# Altium schematic sheet STMWidthSensing.SchDoc
size 297 x 209 mm
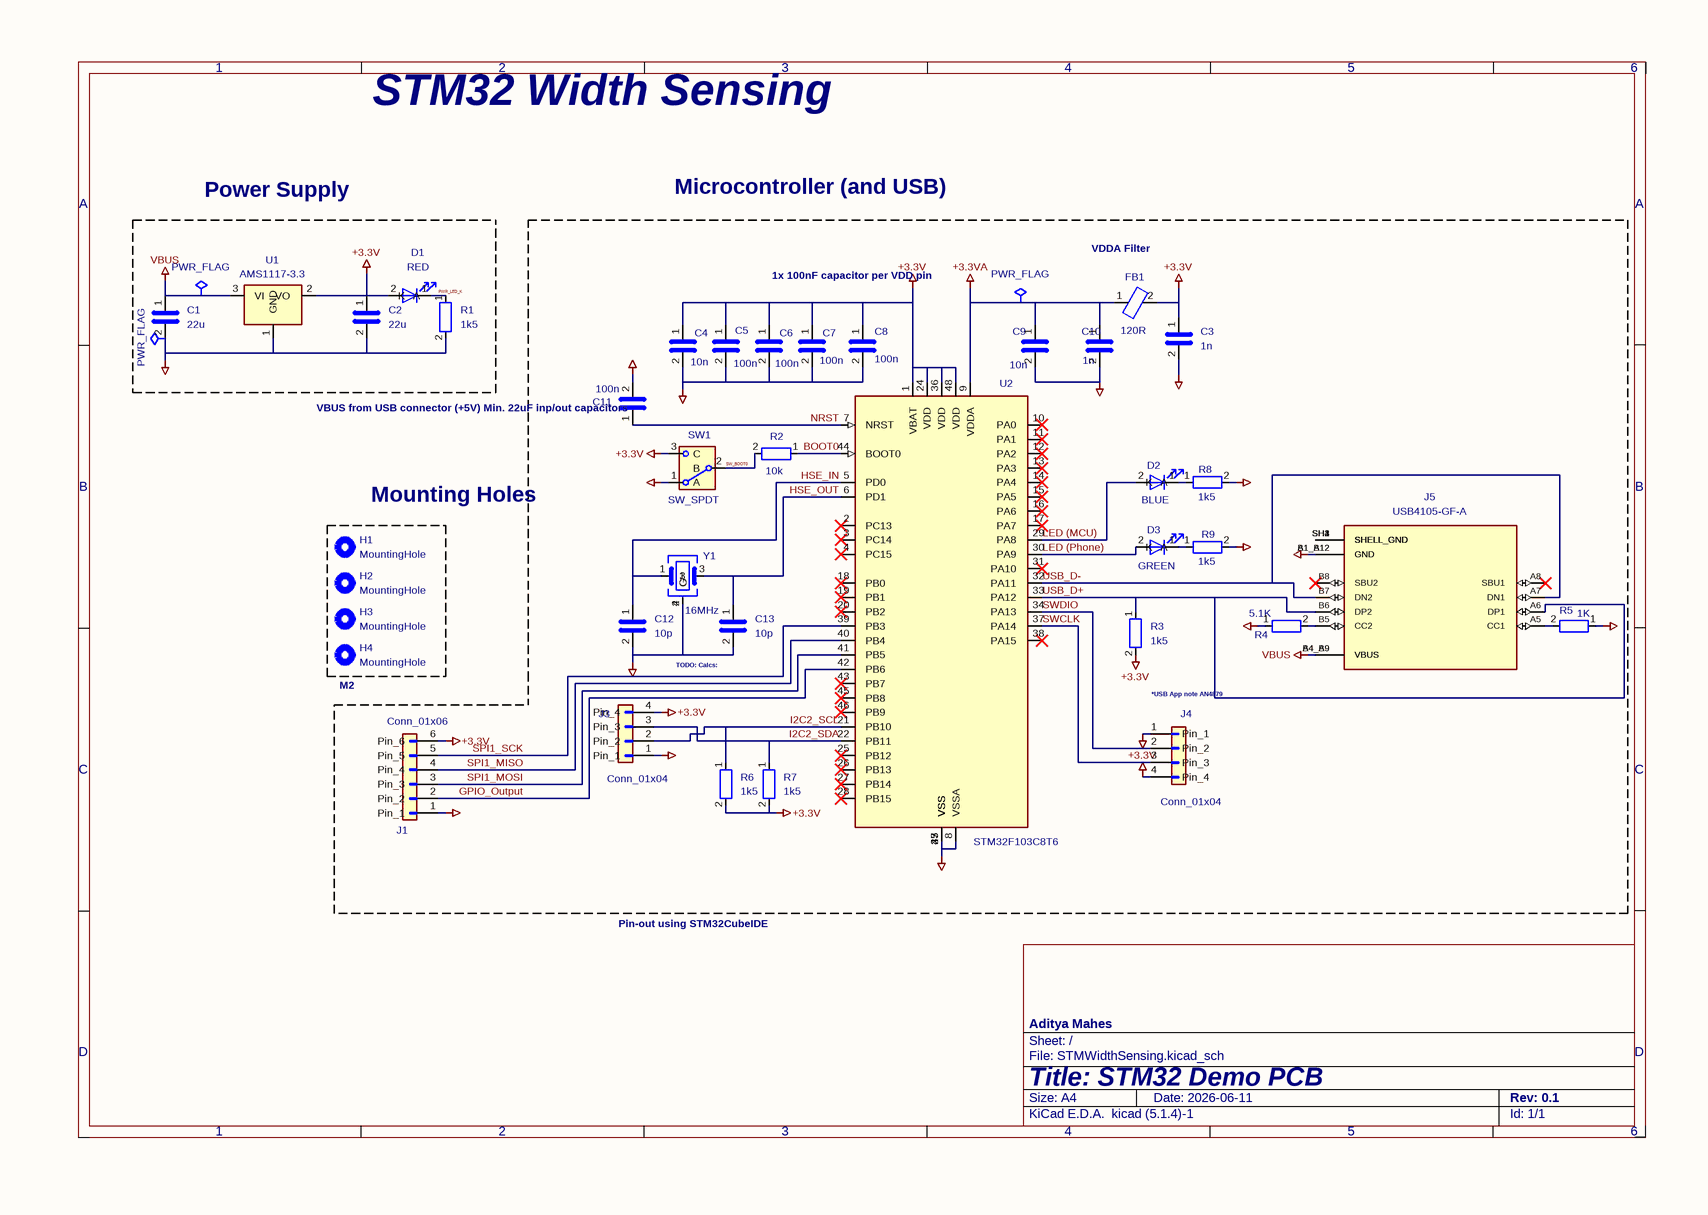
[diagram p0: STMWidthSensing.SchDoc]

## Parts
#FLG01  PWR_FLAG  (graphical)
#FLG02  PWR_FLAG  (graphical)
#FLG03  PWR_FLAG  (graphical)
C1  22u  [C_0805_2012Metric]
C2  22u  [C_0805_2012Metric]
C3  1n  [C_0402_1005Metric]
C4  10n  [C_0603_1608Metric]
C5  100n  [C_0402_1005Metric]
C6  100n  [C_0402_1005Metric]
C7  100n  [C_0402_1005Metric]
C8  100n  [C_0402_1005Metric]
C9  10n  [C_0402_1005Metric]
C10  1n  [C_0402_1005Metric]
C11  100n  [C_0402_1005Metric]
C12  10p  [C_0402_1005Metric]
C13  10p  [C_0402_1005Metric]
D1  RED  [LED_0603_1608Metric]
D2  BLUE  [LED_0603_1608Metric]
D3  GREEN  [LED_0603_1608Metric]
FB1  120R  [L_0603_1608Metric]
H1  MountingHole  [MountingHole_2.2mm_M2]
H2  MountingHole  [MountingHole_2.2mm_M2]
H3  MountingHole  [MountingHole_2.2mm_M2]
H4  MountingHole  [MountingHole_2.2mm_M2]
J1  Conn_01x06  [PinHeader_1x06_P2.54mm_Vertical]
J3  Conn_01x04  [PinHeader_1x04_P2.54mm_Vertical]
J4  Conn_01x04  [PinHeader_1x04_P2.54mm_Vertical]
J5  USB4105-GF-A  [GCT_USB4105-GF-A]
R1  1k5  [R_0402_1005Metric]
R2  10k  [R_0402_1005Metric]
R3  1k5  [R_0402_1005Metric]
R4  5.1K  [R_0402_1005Metric]
R5  1K  [R_0402_1005Metric]
R6  1k5  [R_0402_1005Metric]
R7  1k5  [R_0402_1005Metric]
R8  1k5  [R_0402_1005Metric]
R9  1k5  [R_0402_1005Metric]
SW1  SW_SPDT  [SW_SPDT_PCM12]
U1  AMS1117-3.3  [SOT-223-3_TabPin2]
U2  STM32F103C8T6  [LQFP-48_7x7mm_P0.5mm]
Y1  16MHz  [Crystal_SMD_3225-4Pin_3.2x2.5mm]

## Blocks framed on the sheet
Power Supply /: #FLG01 #FLG03 C1 C2 D1 R1 U1
Mounting Holes /: H1-H4

## Nets
+3.3V: C2.1 C3.1 C4.1 C5.1 C6.1 C7.1 C8.1 D1.2(A) FB1.2 J1.6(Pin_6) J3.4(Pin_4) J4.4(Pin_4) R3.2 R6.2 R7.2 SW1.3(C) U1.2(VO) U2.1(VBAT) U2.24(VDD) U2.36(VDD) U2.48(VDD)
+3.3VA: #FLG02.1 C9.1 C10.1 FB1.1 U2.9(VDDA)
GND: #FLG03.1 C1.2 C2.2 C3.2 C4.2 C5.2 C6.2 C7.2 C8.2 C9.2 C10.2 C11.2 C12.2 C13.2 J1.1(Pin_1) J3.1(Pin_1) J4.1(Pin_1) J5.A1_B12(GND) J5.B1_A12(GND) R1.2 R4.1 R5.1 R8.2 R9.2 SW1.1(A) U1.1(GND) U2.8(VSSA) U2.23(VSS) U2.35(VSS) U2.47(VSS) Y1.2(G) Y1.4(G)
VBUS: #FLG01.1 C1.1 J5.A4_B9(VBUS) J5.B4_A9(VBUS) U1.3(VI)
BOOT0: R2.1 U2.44(BOOT0)
GPIO_Output: J1.2(Pin_2) U2.42(PB6)
HSE_IN: C12.1 U2.5(PD0) Y1.1
HSE_OUT: C13.1 U2.6(PD1) Y1.3
I2C2_SCL: J3.2(Pin_2) R6.1 U2.21(PB10)
I2C2_SDA: J3.3(Pin_3) R7.1 U2.22(PB11)
LED (MCU): D2.2(A) U2.29(PA8)
LED (Phone): D3.2(A) U2.30(PA9)
NRST: C11.1 U2.7(NRST)
PWR_LED_K: D1.1(K) R1.1
SPI1_MISO: J1.4(Pin_4) U2.40(PB4)
SPI1_MOSI: J1.3(Pin_3) U2.41(PB5)
SPI1_SCK: J1.5(Pin_5) U2.39(PB3)
SW_BOOT0: R2.2 SW1.2(B)
SWCLK: J4.3(Pin_3) U2.37(PA14)
SWDIO: J4.2(Pin_2) U2.34(PA13)
USB_D+: J5.A6(DP1) J5.B6(DP2) R3.1 U2.33(PA12)
USB_D-: J5.A7(DN1) J5.B7(DN2) U2.32(PA11)
NetD2_1: D2.1(K) R8.1
NetD3_1: D3.1(K) R9.1
NetJ5_A5: J5.A5(CC1) R5.2
NetJ5_B5: J5.B5(CC2) R4.2
NetJ5_SH1: J5.SH1(SHELL_GND) J5.SH2(SHELL_GND) J5.SH3(SHELL_GND) J5.SH4(SHELL_GND)

Not connected (* = marked no-connect by the designer): J5 A8(SBU1)* B8(SBU2)*; U2 2(PC13)* 3(PC14)* 4(PC15)* 10(PA0)* 11(PA1)* 12(PA2)* 13(PA3)* 14(PA4)* 15(PA5)* 16(PA6)* 17(PA7)* 18(PB0)* 19(PB1)* 20(PB2)* 25(PB12)* 26(PB13)* 27(PB14)* 28(PB15)* 31(PA10)* 38(PA15)* 43(PB7)* 45(PB8)* 46(PB9)*

## Notes on the sheet
- STM32 Width Sensing
- Microcontroller (and USB)
- 1x 100nF capacitor per VDD pin
- (near FB1) VDDA Filter
- (near C11) VBUS from USB connector (+5V) Min. 22uF inp/out capacitors
- (near H4) M2
- TODO: Calcs:
- *USB App note AN4879
- Pin-out using STM32CubeIDE
- 1
- 2
- 3
- 4
- 5
- 6
- A
- B
- C
- D
- Title: STM32 Demo PCB
- File: STMWidthSensing.kicad_sch
- Sheet: /
- Aditya Mahes
- KiCad E.D.A.  kicad (5.1.4)-1
- Size: A4
- Date: 2026-06-11
- Rev: 0.1
- Id: 1/1

## Library data of the parts
#FLG01 #FLG02 #FLG03 = PWR_FLAG: Description: Special symbol for telling ERC where power comes from; Value: PWR_FLAG
C1-C13 = C: Description: Unpolarized capacitor
  C1 C2: Value: 22u; Footprint: Capacitor_SMD:C_0805_2012Metric
  C3 C10: Value: 1n; Footprint: Capacitor_SMD:C_0402_1005Metric
  C4: Value: 10n; Footprint: Capacitor_SMD:C_0603_1608Metric
  C5-C8 C11: Value: 100n; Footprint: Capacitor_SMD:C_0402_1005Metric
  C9: Value: 10n; Footprint: Capacitor_SMD:C_0402_1005Metric
  C12 C13: Value: 10p; Footprint: Capacitor_SMD:C_0402_1005Metric
D1-D3 = LED: Description: Light emitting diode; Sim.Pins: 1=K 2=A; Footprint: LED_SMD:LED_0603_1608Metric
  D1: Value: RED
  D2: Value: BLUE
  D3: Value: GREEN
FB1 = FerriteBead: Description: Ferrite bead; Value: 120R; Footprint: Inductor_SMD:L_0603_1608Metric
H1-H4 = MountingHole: Description: Mounting Hole without connection; Value: MountingHole; Footprint: MountingHole:MountingHole_2.2mm_M2
J1 = Conn_01x06: Description: Generic connector, single row, 01x06, script generated (kicad-library-utils/schlib/autogen/connector/); Value: Conn_01x06; Footprint: Connector_PinHeader_2.54mm:PinHeader_1x06_P2.54mm_Vertical
J3 J4 = Conn_01x04: Description: Generic connector, single row, 01x04, script generated (kicad-library-utils/schlib/autogen/connector/); Value: Conn_01x04; Footprint: Connector_PinHeader_2.54mm:PinHeader_1x04_P2.54mm_Vertical
J5 = USB4105-GF-A: MF: GCT; Description_1: USB-C (USB TYPE-C) USB 2.0 Receptacle Connector 24 (16+8 Dummy) Position Surface Mount, Right Angle; Through Hole; MAXIMUM_PACKAGE_HEIGHT: 3.31 mm; Package: None; Price: None; Check_prices: https://www.snapeda.com/parts/USB4105-GF-A/Global+Connector+Technology/view-part/?ref=eda; STANDARD: Manufacturer Recommendations; PARTREV: B4; SnapEDA_Link: https://www.snapeda.com/parts/USB4105-GF-A/Global+Connector+Technology/view-part/?ref=snap; MP: USB4105-GF-A; Availability: In Stock; MANUFACTURER: GCT; Value: USB4105-GF-A; Footprint: Library:GCT_USB4105-GF-A
R1-R9 = R: Description: Resistor; Footprint: Resistor_SMD:R_0402_1005Metric
  R1 R3 R6-R9: Value: 1k5
  R2: Value: 10k
  R4: Value: 5.1K
  R5: Value: 1K
SW1 = SW_SPDT: Description: Switch, single pole double throw; Value: SW_SPDT; Footprint: Button_Switch_SMD:SW_SPDT_PCM12
U1 = AMS1117-3.3: Description: 1A Low Dropout regulator, positive, 3.3V fixed output, SOT-223; Value: AMS1117-3.3; Footprint: Package_TO_SOT_SMD:SOT-223-3_TabPin2
U2 = STM32F103C8Tx: Description: STMicroelectronics Arm Cortex-M3 MCU, 64KB flash, 20KB RAM, 72 MHz, 2.0-3.6V, 37 GPIO, LQFP48; Value: STM32F103C8T6; Footprint: Package_QFP:LQFP-48_7x7mm_P0.5mm
Y1 = Crystal_GND24: Description: Four pin crystal, GND on pins 2 and 4; private: KLC_S3.3; private: KLC_S4.1; Value: 16MHz; Footprint: Crystal:Crystal_SMD_3225-4Pin_3.2x2.5mm